# EAGLE design maze_expander_1_0 (EAGLE 6.6.0)
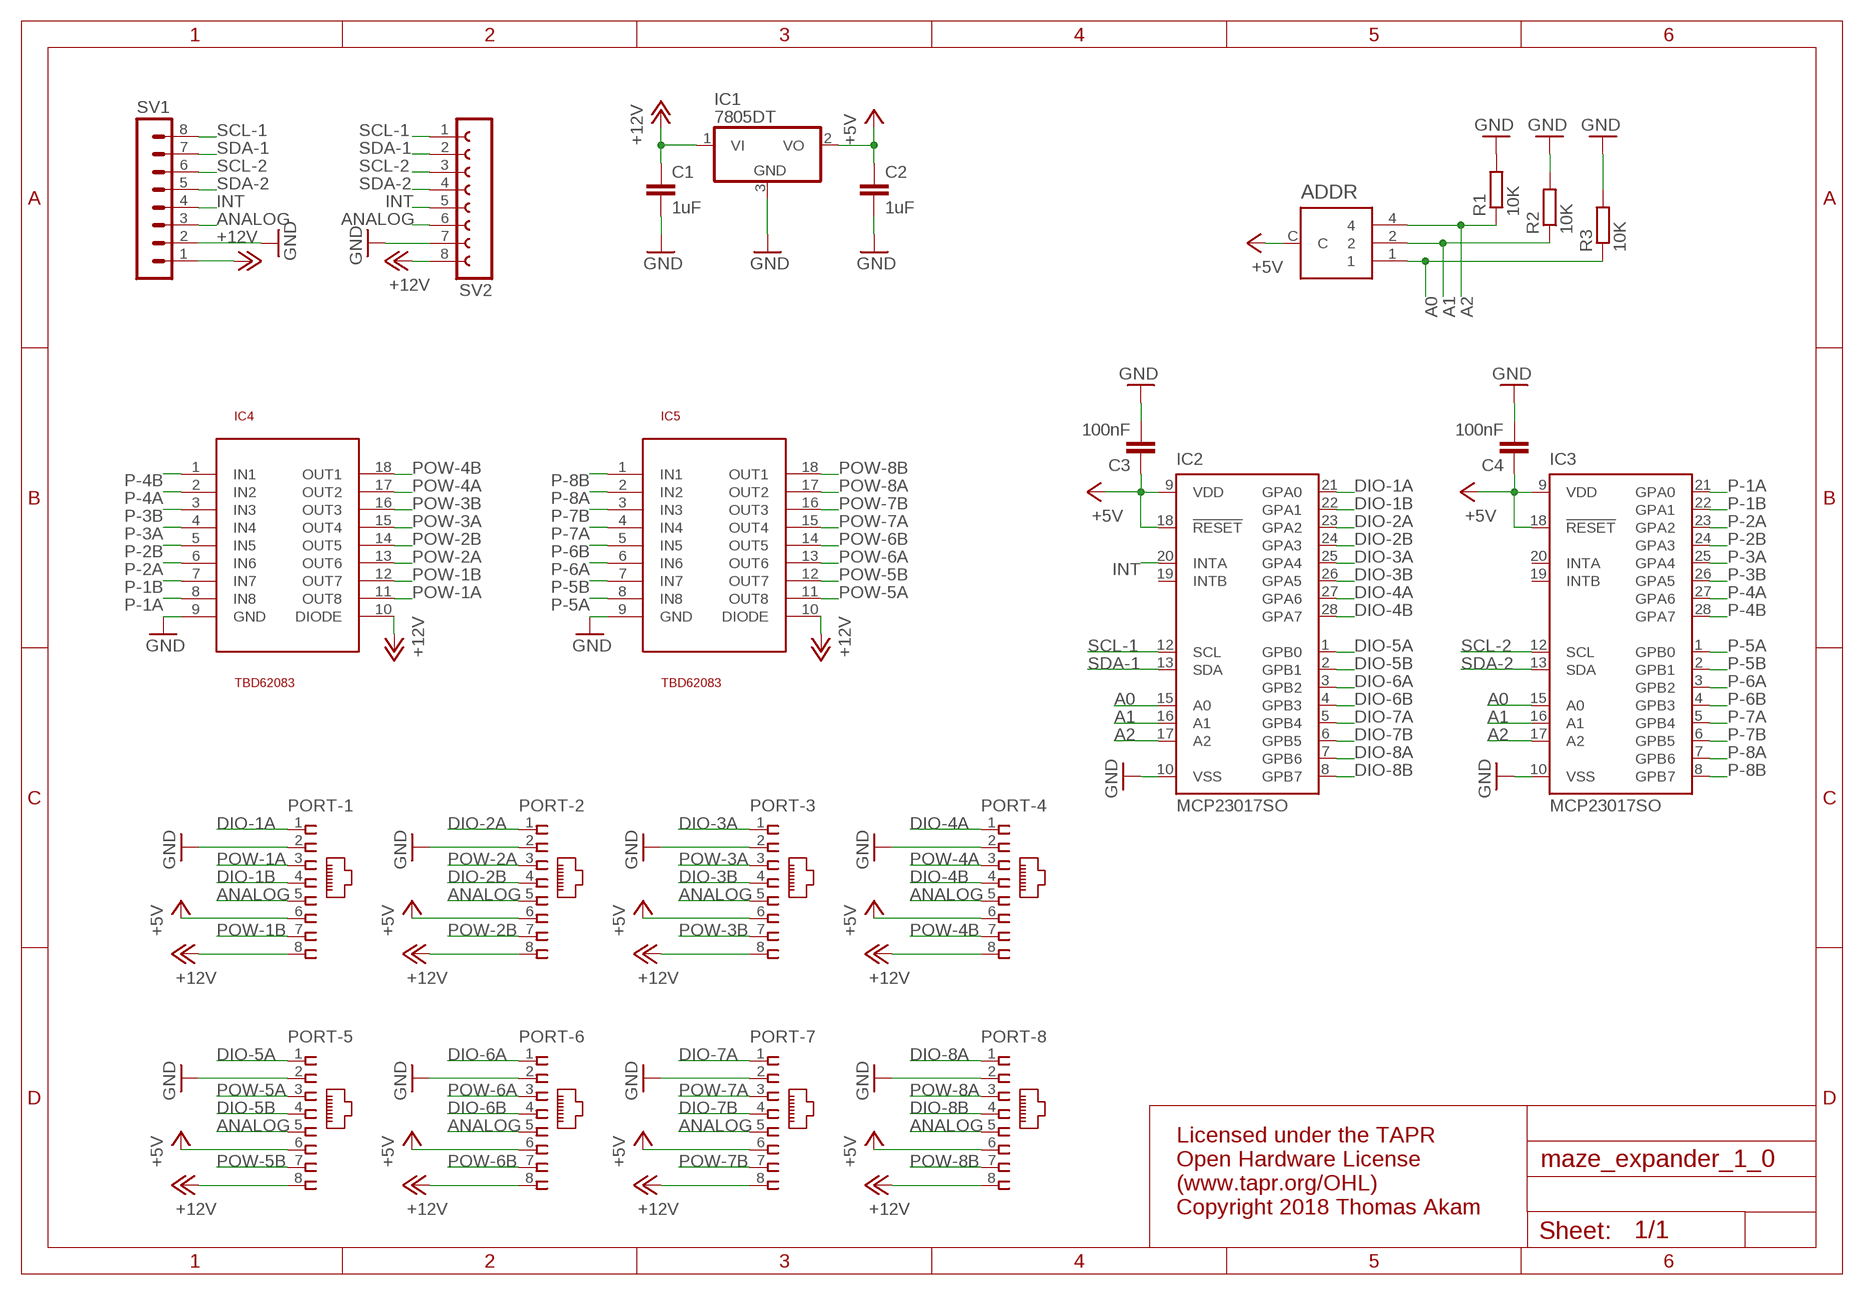
[diagram p0: schematic, sheet 1]

## Parts
ADDR  S-8010  [S-8010]
C1  1uF  C-EUC0805  [C0805]
C2  1uF  C-EUC0805  [C0805]
C3  100nF  C-EUC0805  [C0805]
C4  100nF  C-EUC0805  [C0805]
IC1  7805DT  [TO252]
IC2  MCP23017SO  [SO28W]
IC3  MCP23017SO  [SO28W]
IC4  TBD62083  ULN2803  [SO18L]
IC5  TBD62083  ULN2803  [SO18L]
PORT-1  RJ45VERTICAL  [RJ45-NO-SHIELD-VERTICAL]
PORT-2  RJ45VERTICAL  [RJ45-NO-SHIELD-VERTICAL]
PORT-3  RJ45VERTICAL  [RJ45-NO-SHIELD-VERTICAL]
PORT-4  RJ45VERTICAL  [RJ45-NO-SHIELD-VERTICAL]
PORT-5  RJ45VERTICAL  [RJ45-NO-SHIELD-VERTICAL]
PORT-6  RJ45VERTICAL  [RJ45-NO-SHIELD-VERTICAL]
PORT-7  RJ45VERTICAL  [RJ45-NO-SHIELD-VERTICAL]
PORT-8  RJ45VERTICAL  [RJ45-NO-SHIELD-VERTICAL]
R1  10K  R-EU_R0805  [R0805]
R2  10K  R-EU_R0805  [R0805]
R3  10K  R-EU_R0805  [R0805]
SV1  MA08-1W  [MA08-1W]
SV2  FE08W  [FE08W]

## Nets
+5V: ADDR.C C2.1 C3.1 C4.1 IC1.2(VO) IC2.9(VDD) IC2.18(!RESET) IC3.9(VDD) IC3.18(!RESET) PORT-1.6 PORT-2.6 PORT-3.6 PORT-4.6 PORT-5.6 PORT-6.6 PORT-7.6 PORT-8.6
+12V: C1.1 IC1.1(VI) IC4.10(DIODE) IC5.10(DIODE) PORT-1.8 PORT-2.8 PORT-3.8 PORT-4.8 PORT-5.8 PORT-6.8 PORT-7.8 PORT-8.8 SV1.1 SV2.8
A0: ADDR.1 IC2.15(A0) IC3.15(A0) R3.1
A1: ADDR.2 IC2.16(A1) IC3.16(A1) R2.1
A2: ADDR.4 IC2.17(A2) IC3.17(A2) R1.1
ANALOG: PORT-1.5 PORT-2.5 PORT-3.5 PORT-4.5 PORT-5.5 PORT-6.5 PORT-7.5 PORT-8.5 SV1.3 SV2.6
DIO-1A: IC2.21(GPA0) PORT-1.1
DIO-1B: IC2.22(GPA1) PORT-1.4
DIO-2A: IC2.23(GPA2) PORT-2.1
DIO-2B: IC2.24(GPA3) PORT-2.4
DIO-3A: IC2.25(GPA4) PORT-3.1
DIO-3B: IC2.26(GPA5) PORT-3.4
DIO-4A: IC2.27(GPA6) PORT-4.1
DIO-4B: IC2.28(GPA7) PORT-4.4
DIO-5A: IC2.1(GPB0) PORT-5.1
DIO-5B: IC2.2(GPB1) PORT-5.4
DIO-6A: IC2.3(GPB2) PORT-6.1
DIO-6B: IC2.4(GPB3) PORT-6.4
DIO-7A: IC2.5(GPB4) PORT-7.1
DIO-7B: IC2.6(GPB5) PORT-7.4
DIO-8A: IC2.7(GPB6) PORT-8.1
DIO-8B: IC2.8(GPB7) PORT-8.4
GND: C1.2 C2.2 C3.2 C4.2 IC1.3(GND) IC2.10(VSS) IC3.10(VSS) IC4.9(GND) IC5.9(GND) PORT-1.2 PORT-2.2 PORT-3.2 PORT-4.2 PORT-5.2 PORT-6.2 PORT-7.2 PORT-8.2 R1.2 R2.2 R3.2 SV1.2 SV2.7
INT: IC2.20(INTA) SV1.4 SV2.5
P-1A: IC3.21(GPA0) IC4.8(IN8)
P-1B: IC3.22(GPA1) IC4.7(IN7)
P-2A: IC3.23(GPA2) IC4.6(IN6)
P-2B: IC3.24(GPA3) IC4.5(IN5)
P-3A: IC3.25(GPA4) IC4.4(IN4)
P-3B: IC3.26(GPA5) IC4.3(IN3)
P-4A: IC3.27(GPA6) IC4.2(IN2)
P-4B: IC3.28(GPA7) IC4.1(IN1)
P-5A: IC3.1(GPB0) IC5.8(IN8)
P-5B: IC3.2(GPB1) IC5.7(IN7)
P-6A: IC3.3(GPB2) IC5.6(IN6)
P-6B: IC3.4(GPB3) IC5.5(IN5)
P-7A: IC3.5(GPB4) IC5.4(IN4)
P-7B: IC3.6(GPB5) IC5.3(IN3)
P-8A: IC3.7(GPB6) IC5.2(IN2)
P-8B: IC3.8(GPB7) IC5.1(IN1)
POW-1A: IC4.11(OUT8) PORT-1.3
POW-1B: IC4.12(OUT7) PORT-1.7
POW-2A: IC4.13(OUT6) PORT-2.3
POW-2B: IC4.14(OUT5) PORT-2.7
POW-3A: IC4.15(OUT4) PORT-3.3
POW-3B: IC4.16(OUT3) PORT-3.7
POW-4A: IC4.17(OUT2) PORT-4.3
POW-4B: IC4.18(OUT1) PORT-4.7
POW-5A: IC5.11(OUT8) PORT-5.3
POW-5B: IC5.12(OUT7) PORT-5.7
POW-6A: IC5.13(OUT6) PORT-6.3
POW-6B: IC5.14(OUT5) PORT-6.7
POW-7A: IC5.15(OUT4) PORT-7.3
POW-7B: IC5.16(OUT3) PORT-7.7
POW-8A: IC5.17(OUT2) PORT-8.3
POW-8B: IC5.18(OUT1) PORT-8.7
SCL-1: IC2.12(SCL) SV1.8 SV2.1
SCL-2: IC3.12(SCL) SV1.6 SV2.3
SDA-1: IC2.13(SDA) SV1.7 SV2.2
SDA-2: IC3.13(SDA) SV1.5 SV2.4
Unconnected: IC2.19(INTB) IC3.19(INTB) IC3.20(INTA)

## Notes on the sheet
- Licensed under the TAPR
  Open Hardware License
  (www.tapr.org/OHL)
  Copyright 2018 Thomas Akam

## Library data of the parts
ADDR = ultra_librarian:S-8010: NIDEC COPAL ELECTRONICS S-8010 coded rotary switch
C1-C4 = resistor:C-EU: CAPACITOR, European symbol
IC1 = linear:78*: Positive VOLTAGE REGULATOR Source: http://cache.national.com/ds/LM/LM78L05.pdf http://www.fairchildsemi.com/ds/LM/LM7805.pdf
IC2 IC3 = microchip:MCP23017: http://ww1.microchip.com/downloads/en/DeviceDoc/21952a.pdf Source: http://ww1.microchip.com/downloads/en/DeviceDoc/21952a.pdf; MF: MICROCHIP; MPN: MCP23017-E/SO; OC_FARNELL: 1332087; OC_NEWARK: 31K2958
IC4 IC5 = uln2803:ULN2803
PORT-1-PORT-8 = con-tycoelectronics-vertical_RJ45:RJ45: CORCOM Modular RJ Jacks No Shield Source: www.tycoelectronics.com .. ENG_DS_1654001_1099_RJ_L_0507.pdf
R1-R3 = rcl:R-EU_: RESISTOR, European symbol
SV1 = con-lstb:MA08-1W: PIN HEADER; OC_FARNELL: unknown; OC_NEWARK: unknown
SV2 = con-lsta:FE08W: FEMALE HEADER; OC_FARNELL: unknown; OC_NEWARK: unknown

## Board
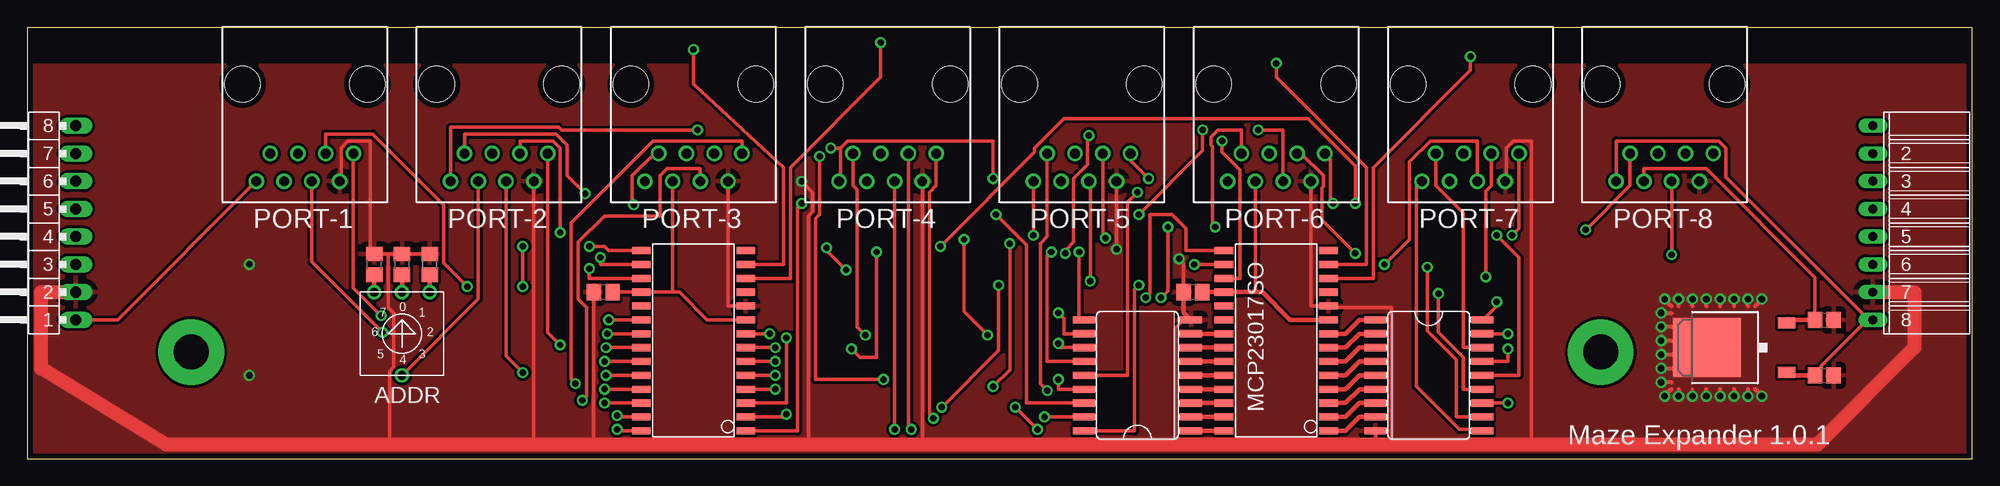
[diagram p1: board, top side]
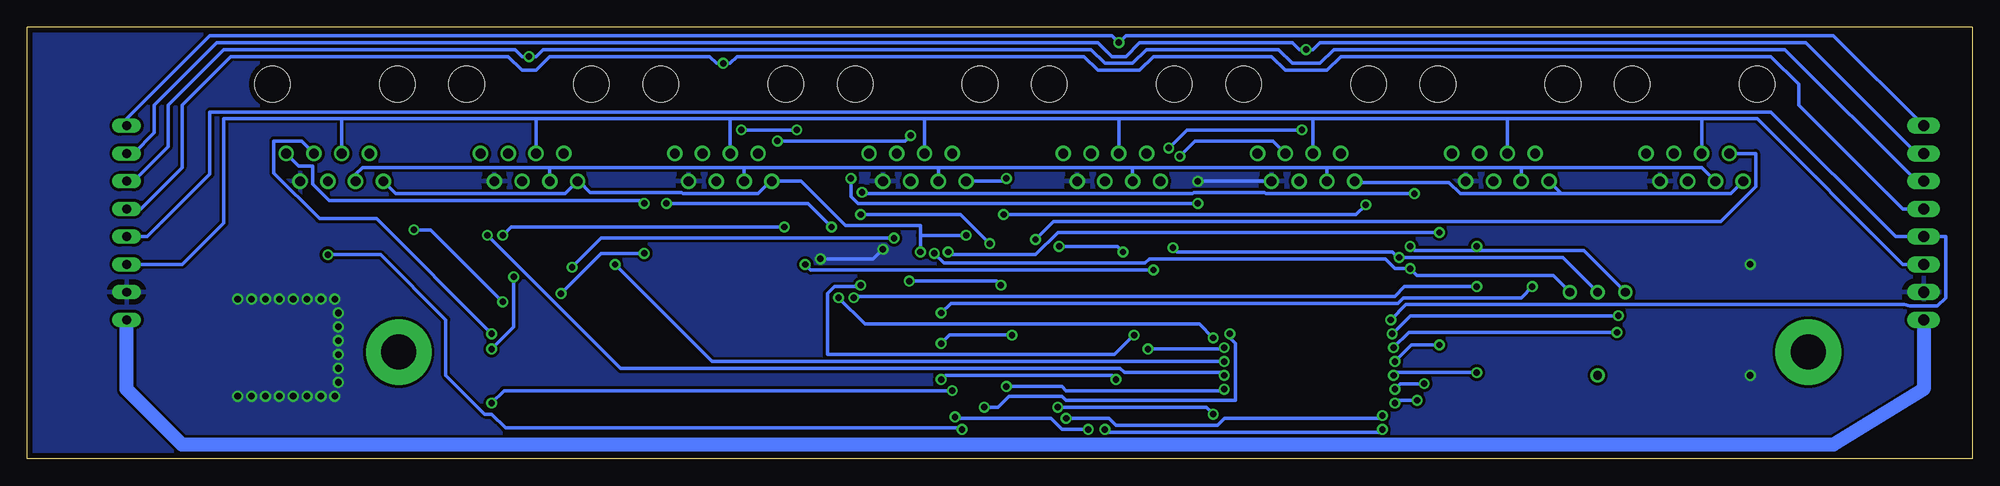
[diagram p2: board, bottom side, seen from below]

Size 178 x 39.5 mm. Coordinates in mm from the lower left corner, seen from the top.
Outline: 0,0 178,0 178,39.5 0,39.5 0,0
Copper layers (1*16): Top 0.035mm / dielectric 1.5mm / Bottom 0.035mm
Design rules "default *": minimum track width 12mil, minimum drill 23mil, track to track 10mil, track to pad 10mil, pad to pad 10mil, via to via 10mil, smd to smd 10mil, copper to edge 20mil, drill to drill 8mil, minimum pad ring 10mil, minimum via ring 8mil, stop-mask expansion 4mil, vias tented up to drill 0mil, thermal gap 20mil
tRestrict: area 0,36.2 to 178,39.5
vRestrict: area 57.1,1.9 to 64.8,19.8; area 97.8,1.8 to 105.4,13.6; area 20.3,21 to 29.8,22.9; area 55.9,21 to 65.4,22.9; area 110.2,1.8 to 117.9,19.6; area 124.8,1.8 to 132.5,13.2; area 109.2,21 to 118.7,23.5; area 127,21 to 136.5,23.5; area 144.8,21 to 154.3,23.5; area 73.7,21 to 83.2,23.5; area 91.4,21 to 101,23.5; area 38.1,21 to 47.6,23.5; 2 more areas

### Footprints (pad centres in the part's own frame; a part is rotated, then mirrored left to right if it is on the bottom)
S-8010 = drill 0.8: 1 -2.54,3.81; 2 0,3.81; 4 2.54,3.81; C 0,-3.81
C0805 = smd 1.3 x 1.5: 1 -0.85,0; 2 0.85,0
TO252 = smd 1 x 1.6: 1 -2.28,-4.8; 2 2.28,-4.8 | smd 5.4 x 6.2: 3 0,2.5
SO28W = smd 0.65 x 1.7: 1 -7.62,-4.78; 2 -6.35,-4.78; 3 -5.08,-4.78; 4 -3.81,-4.78; 5 -2.54,-4.78; 6 -1.27,-4.78; 7 0,-4.78; 8 1.27,-4.78; 9 2.54,-4.78; 10 3.81,-4.78; 11 5.08,-4.78; 12 6.35,-4.78; 13 7.62,-4.78; 14 8.89,-4.78; 15 8.89,4.78; 16 7.62,4.78; 17 6.35,4.78; 18 5.08,4.78; 19 3.81,4.78; 20 2.54,4.78; 21 1.27,4.78; 22 0,4.78; 23 -1.27,4.78; 24 -2.54,4.78; 25 -3.81,4.78; 26 -5.08,4.78; 27 -6.35,4.78; 28 -7.62,4.78
SO18L = smd 0.66 x 2.032: 1 -5.08,-4.902; 2 -3.81,-4.902; 3 -2.54,-4.902; 4 -1.27,-4.902; 5 0,-4.902; 6 1.27,-4.902; 7 2.54,-4.902; 8 3.81,-4.902; 9 5.08,-4.902; 10 5.08,4.902; 11 3.81,4.902; 12 2.54,4.902; 13 1.27,4.902; 14 0,4.902; 15 -1.27,4.902; 16 -2.54,4.902; 17 -3.81,4.902; 18 -5.08,4.902
RJ45-NO-SHIELD-VERTICAL = drill 0.9 pad 1.4: 1 -4.445,5.08; 2 -3.175,7.62; 3 -1.905,5.08; 4 -0.635,7.62; 5 0.635,5.08; 6 1.905,7.62; 7 3.175,5.08; 8 4.445,7.62 | hole 3.251: -5.715,-1.27; 5.715,-1.27
R0805 = smd 1.3 x 1.5: 1 -0.95,0; 2 0.95,0
MA08-1W = drill 1.016 long: 1 -8.89,0; 2 -6.35,0; 3 -3.81,0; 4 -1.27,0; 5 1.27,0; 6 3.81,0; 7 6.35,0; 8 8.89,0
FE08W = drill 0.813 long: 1 -8.89,0; 2 -6.35,0; 3 -3.81,0; 4 -1.27,0; 5 1.27,0; 6 3.81,0; 7 6.35,0; 8 8.89,0

### Placement (x,y rotation side)
ADDR  34.29,11.43 0 top
C1  164.47,7.62 0 top
C2  164.47,12.7 0 top
C3  52.7,15.24 180 top
C4  106.68,15.24 180 top
IC1  156.21,10.16 90 top
IC2  60.96,10.16 90 top
IC3  114.3,10.16 90 top
IC4  101.6,7.62 90 top
IC5  128.27,7.62 270 top
PORT-1  25.4,33.02 180 top
PORT-2  43.18,33.02 180 top
PORT-3  60.96,33.02 180 top
PORT-4  78.74,33.02 180 top
PORT-5  96.52,33.02 180 top
PORT-6  114.3,33.02 180 top
PORT-7  132.08,33.02 180 top
PORT-8  149.86,33.02 180 top
R1  36.83,17.78 90 top
R2  34.29,17.78 90 top
R3  31.75,17.78 90 top
SV1  4.45,21.59 90 top
SV2  168.91,21.59 270 top

### Tracks (layer width: path | path; a pad name or v marks a point on that pad's centre or on a via)
+5V
  Top 0.305: IC2.18 C3.1 59.05,15.24 | 59.05,15.24 59.69,15.24 62.23,12.7 IC2.9 | PORT-8.6 147.96,26.54 153.67,26.54 163.62,16.6 C2.1 | 161.16,12.83 IC1.2 | ADDR.C 41.27,14.61 PORT-2.6 | PORT-6.6 112.39,15.24 | PORT-3.6 59.05,15.24
  Top 0.406: C4.1 IC3.18 112.39,15.24 113.03,15.24 115.57,12.7 IC3.9 | C2.1 161.27,12.7 IC1.2
  Bottom 0.305: PORT-1.6 24.77,26.67 41.27,26.67 | 41.27,26.67 59.05,26.67 | 59.05,26.67 76.83,26.67 | 76.83,26.67 94.61,26.67 | 94.61,26.67 112.39,26.67 | 112.39,26.67 130.18,26.67 | 130.18,26.67 147.32,26.67 147.96,26.04 PORT-8.6 | PORT-2.6 41.27,26.67 | PORT-3.6 59.05,26.67 | PORT-4.6 76.83,26.67 | PORT-5.6 94.61,26.67 | PORT-6.6 112.39,26.67 | PORT-7.6 130.18,26.67
+12V  (via drill 0.58)
  Top 0.305: PORT-4.8 74.42,25.53 74.42,28.45 | 74.42,28.45 75.06,29.08 88.39,29.08 v88.39,25.65 | v96.27,18.92 96.27,13.08 96.65,12.7 IC4.10 | v92.08,20.45 PORT-5.8 | 163.7,7.75 C1.1 163.7,7.87 164.21,8.38 164.21,8.51 168.4,12.7 SV2.8 168.4,12.83 155.45,25.78 155.45,28.45 154.81,29.08 145.41,29.08 PORT-8.8 | PORT-1.8 8.26,12.7 SV1.1 | PORT-7.8 127.13,24.89 127.13,6.6 131.06,2.67 133.1,2.67 IC5.10 | v73.53,28.45 74.42,28.45 | v61.34,30.1 48.9,30.1 48.64,30.35 38.73,30.35 PORT-2.8
  Top 0.406: C1.1 161.27,7.62 IC1.1
  Bottom 0.305: v88.39,25.65 88.65,25.4 PORT-5.8 | PORT-8.8 144.27,24.26 128.78,24.26 PORT-7.8 127.51,25.4 126.49,24.38 118.11,24.38 117.98,24.26 111.12,24.26 109.98,25.4 PORT-6.8 107.19,25.4 103.12,21.34 96.27,21.34 96.27,20.45 | 96.27,20.45 v96.27,18.92 | 96.27,20.45 v92.08,20.45 | PORT-1.8 22.1,24.26 37.59,24.26 | PORT-2.8 37.59,24.26 | PORT-3.8 56.39,25.27 47.88,25.27 46.86,24.26 37.59,24.26 | v73.53,28.45 71.88,30.1 v61.34,30.1
  Bottom 1.27: SV1.1 4.45,6.35 12.7,1.27 163.83,1.27 168.91,6.35 SV2.8
A0  (via drill 0.58)
  Top 0.305: 55.88,19.05 IC2.15 53.21,19.05 52.83,19.43 v51.44,19.43 | IC3.15 106.05,19.05 106.05,21.08 104.78,22.35 102.74,22.35 102.74,15.11 v102.36,14.73 | v45.34,19.43 v45.34,15.75
  Top 0.406: ADDR.1 R3.1
  Bottom 0.305: v51.44,19.43 51.05,19.05 45.34,19.05 | 45.34,19.05 35.56,19.05 ADDR.1 | v102.36,14.73 102.23,14.86 52.83,14.86 51.94,15.75 v45.34,15.75 | 45.34,19.05 v45.34,19.43
A1  (via drill 0.58)
  Top 0.305: IC2.16 52.45,17.78 v52.45,18.41 | v106.81,17.78 IC3.16 | v74.93,17.27 73.15,19.05 v73.15,19.3
  Top 0.406: ADDR.2 R2.1
  Bottom 0.305: ADDR.2 37.47,18.41 v52.45,18.41 52.58,18.41 53.09,18.92 72.77,18.92 v73.15,19.3 | v106.81,17.78 106.3,17.27 v74.93,17.27
A2  (via drill 0.58)
  Top 0.305: IC2.17 51.44,16.51 v51.44,17.4 | IC3.17 111,16.51 111,26.42 109.35,28.07 v109.35,29.08 | v97.16,29.59 97.03,29.46 97.03,26.92 95.76,25.65 95.76,19.81 95,19.05 v95,18.8
  Top 0.406: ADDR.4 R1.1
  Bottom 0.305: ADDR.4 38.35,16.76 50.8,16.76 v51.44,17.4 52.83,17.4 53.72,18.29 75.31,18.29 75.69,17.91 94.11,17.91 v95,18.8 | v109.35,29.08 97.66,29.08 v97.16,29.59
ANALOG
  Bottom 0.305: SV1.3 6.35,17.78 19.68,31.11 24.77,31.11 | 24.77,31.11 42.55,31.11 | 42.55,31.11 60.33,31.11 | 60.33,31.11 78.11,31.11 | 78.11,31.11 95.89,31.11 | 95.89,31.11 113.67,31.11 | 113.67,31.11 131.44,31.11 | 131.44,31.11 149.22,31.11 | 149.22,31.11 160.02,31.11 160.02,21.59 163.83,17.78 SV2.6 | PORT-1.5 24.77,31.11 | PORT-2.5 42.55,31.11 | PORT-3.5 60.33,31.11 | PORT-4.5 78.11,31.11 | PORT-5.5 95.89,31.11 | PORT-6.5 113.67,31.11 | PORT-7.5 131.44,31.11 | PORT-8.5 149.22,31.11
DIO-1A  (via drill 0.58)
  Top 0.305: v53.09,11.43 IC2.21 | v32.38,13.08 29.84,15.62 PORT-1.1
  Bottom 0.305: v53.09,11.43 51.44,13.08 v32.38,13.08
DIO-1B  (via drill 0.58)
  Top 0.305: v52.96,10.16 IC2.22 | v32.51,11.56 26.04,18.03 PORT-1.4
  Bottom 0.305: v52.96,10.16 51.56,11.56 v32.51,11.56
DIO-2A  (via drill 0.58)
  Top 0.305: v52.83,8.89 IC2.23 | v48.77,10.41 47.62,11.56 PORT-2.1
  Bottom 0.305: v52.83,8.89 51.31,10.41 v48.77,10.41
DIO-2B  (via drill 0.58)
  Top 0.305: v52.96,7.62 IC2.24 | v45.34,7.87 43.81,9.4 PORT-2.4
  Bottom 0.305: v52.96,7.62 52.7,7.87 v45.34,7.87
DIO-3A  (via drill 0.58)
  Top 0.305: v52.83,6.35 IC2.25 | v50.16,6.86 49.78,7.24 49.78,21.59 57.28,29.08 65.41,29.08 PORT-3.1
  Bottom 0.305: v52.83,6.35 52.32,6.86 v50.16,6.86
DIO-3B  (via drill 0.58)
  Top 0.305: v52.83,5.08 IC2.26 | v50.8,5.33 51.18,5.71 51.18,13.84 50.42,14.61 50.42,19.81 52.83,22.23 57.91,22.23 57.91,25.91 58.55,26.54 61.59,26.54 PORT-3.4
  Bottom 0.305: v52.83,5.08 52.58,5.33 v50.8,5.33
DIO-4A  (via drill 0.58)
  Top 0.305: IC2.27 53.98,3.81 v53.98,3.94 | v82.93,3.68 82.55,4.06 82.55,24.38 83.19,25.02 PORT-4.1
  Bottom 0.305: v53.98,3.94 54.23,3.68 68.45,3.68 69.09,3.05 78.36,3.05 78.99,3.68 v82.93,3.68
DIO-4B  (via drill 0.58)
  Top 0.305: IC2.28 53.98,2.54 v53.98,2.67 | PORT-4.4 v79.38,2.67
  Bottom 0.305: v53.98,2.67 54.23,2.41 79.12,2.41 v79.38,2.67
DIO-5A  (via drill 0.58)
  Top 0.305: IC2.1 70.48,2.54 70.48,22.99 v70.87,23.37 | v102.62,25.65 100.97,27.3 PORT-5.1
  Bottom 0.305: v70.87,23.37 101.98,23.37 102.62,24 v102.62,25.65
DIO-5B  (via drill 0.58)
  Top 0.305: IC2.2 69.47,3.81 v69.47,4.06 | v83.69,4.7 88.9,9.91 v88.9,15.88 | v97.28,16.26 97.28,25.27 PORT-5.4
  Bottom 0.305: v69.47,4.06 70.1,4.7 v83.69,4.7 | v88.9,15.88 89.28,16.26 v97.28,16.26
DIO-6A  (via drill 0.58)
  Top 0.305: IC2.3 69.47,5.08 v69.47,11.05 | v103.76,14.73 104.39,15.37 v104.39,21.21 | v119.51,23.37 119.25,23.62 119.25,27.43 PORT-6.1
  Bottom 0.305: v69.47,11.05 70.74,12.32 101.35,12.32 v103.76,14.73 | v104.39,21.21 106.55,23.37 v119.51,23.37
DIO-6B  (via drill 0.58)
  Top 0.305: v68.45,6.35 IC2.4 | v88.39,6.6 89.92,8.13 v89.92,19.68 | v101.73,22.35 107.57,28.19 v107.57,30.1 | v112.65,30.1 114.94,30.1 PORT-6.4
  Bottom 0.305: v68.45,6.35 68.58,6.22 82.93,6.22 83.31,6.6 v88.39,6.6 | v89.92,19.68 92.58,22.35 v101.73,22.35 | v112.65,30.1 v107.57,30.1
DIO-7A  (via drill 0.58)
  Top 0.305: v68.45,7.62 IC2.5 | v135.89,20.45 136.53,21.08 PORT-7.1
  Bottom 0.305: v68.45,7.62 68.71,7.87 77.6,7.87 77.98,8.26 123.7,8.26 v135.89,20.45
DIO-7B  (via drill 0.58)
  Top 0.305: v68.45,8.89 IC2.6 | v124.21,17.78 126.49,20.07 126.49,27.18 128.4,29.08 132.72,29.08 PORT-7.4
  Bottom 0.305: v68.45,8.89 115.32,8.89 v124.21,17.78
DIO-8A  (via drill 0.58)
  Top 0.305: v68.45,10.16 IC2.7 | v75.44,10.03 76.2,9.27 77.72,9.27 v77.72,18.92 | v83.57,19.43 92.2,28.07 92.2,28.45 94.87,31.11 117.22,31.11 121.54,26.8 v121.54,23.37
  Bottom 0.305: v68.45,10.16 68.58,10.03 v75.44,10.03 | v77.72,18.92 78.23,19.43 v83.57,19.43 | v121.54,23.37 121.79,23.62 150.37,23.62 151.89,25.15 151.89,26.8 153.16,26.8 PORT-8.1
DIO-8B  (via drill 0.58)
  Top 0.305: v67.94,11.43 IC2.8 | v92.46,2.67 v90.42,4.7 | PORT-8.4 v150.5,18.67
  Bottom 0.305: v67.94,11.43 67.94,11.05 67.44,10.54 67.44,5.33 82.93,5.33 83.31,5.71 88.14,5.71 89.15,4.7 v90.42,4.7 | v92.46,2.67 92.58,2.79 134.24,2.79 135.51,4.06 136.14,4.06 139.7,7.62 139.7,12.7 145.67,18.67 v150.5,18.67
GND  (via drill 0.58, 0.6, 0.61)
  Top 0.305: R1.2 R2.2 33.02,18.73 | 33.02,18.73 R3.2 31.62,18.8 31.37,19.05 31.37,29.08 29.34,29.08 28.7,28.45 28.7,25.53 PORT-1.2 | v99.69,19.18 PORT-5.2 | v105.41,18.29 105.79,17.91 105.79,15.37 C4.2 | PORT-6.2 117.47,13.97 IC3.10 119.13,13.84 124.84,13.84 124.84,1.27 | IC2.10 64.14,13.97 PORT-3.2 | 152.4,6.35 v152.4,5.71 | 165.35,7.62 C1.2 | 51.82,1.27 51.82,15.24 C3.2 | 123.44,1.27 123.44,2.54 IC5.9 | 46.35,1.27 PORT-2.2 | 81.92,1.27 PORT-4.2 | PORT-7.2 135.38,25.53 135.38,28.45 136.02,29.08 137.67,29.08 137.67,1.27 | 33.02,18.73 33.02,13.84 33.53,13.34 33.53,8.38 33.15,8 33.15,1.27 | v70.87,25.4 71.88,24.38 71.88,22.61 71.5,22.23 71.5,1.27 | 105.03,1.27 105.03,11.94 106.05,12.95 IC4.9
  Top 0.356: v149.86,14.61 149.54,14.58 150.32,14.12 150.32,14.07 150.5,13.97 | v154.94,5.71 154.94,6.35 | 151.13,13.97 v151.13,14.61 151.23,14.73 | 152.4,13.97 v152.4,14.61 | 153.67,13.97 v153.67,14.61 | 154.94,13.97 v154.94,14.61 | 156.21,13.97 v156.21,14.61 | 157.48,13.97 v157.48,14.61 | v158.75,14.61 158.75,14.58 158.29,14.12 158.29,14.07 158.12,13.97 | 150.5,13.31 149.54,13.31 v149.54,13.34 | 150.5,12.04 149.54,12.04 v149.54,12.06 | 150.5,10.77 149.54,10.77 v149.54,10.79 | 150.5,9.5 149.54,9.5 v149.54,9.53 | 150.5,8.23 149.54,8.23 v149.54,8.26 | 150.5,6.96 149.54,6.96 v149.54,6.99 | v149.86,5.71 149.54,5.74 150.32,6.2 150.32,6.25 150.5,6.35 | 151.13,6.35 v151.13,5.71 | 156.21,6.35 v156.21,5.71 | 157.48,6.35 v157.48,5.71 | v158.75,5.71 158.75,5.74 158.29,6.2 158.29,6.25 158.12,6.35
  Top 0.406: v153.67,5.71 153.67,6.35 | C4.2 105.83,13.37 IC4.9
  Top 1.27: SV1.2 1.27,15.24 1.27,8.26 12.7,1.27 33.15,1.27 46.35,1.27 51.82,1.27 71.5,1.27 81.92,1.27 105.03,1.27 123.44,1.27 124.84,1.27 137.67,1.27 163.83,1.27 172.72,10.16 172.72,15.24 SV2.7
  Bottom 0.305: v99.69,19.18 100.58,18.29 v105.41,18.29 | v70.87,25.4 PORT-3.2
  Bottom 0.356: 158.75,14.63 v158.75,14.61 158.88,14.73
  other vias: 20.32,17.78 20.32,7.62
  pour Bottom: 0,0 0,39.5 178,39.5 178,0
  pour Top: 0,0 178,0 178,39.5 0,39.5
  pour Top (no thermals): 158.12,13.97 158.12,6.35 149.86,6.35 149.86,13.97
INT  (via drill 0.58)
  Top 0.305: v53.21,12.7 IC2.20
  Bottom 0.305: v53.21,12.7 51.82,14.1 6.22,14.1 5.71,13.97 3.17,13.97 2.41,14.73 2.41,20.32 SV1.4 6.99,20.32 18.41,31.75 161.29,31.75 161.29,26.04 167,20.32 SV2.5
N$2  (via drill 3.2 pad 6)
  other vias: 15,9.75
N$4  (via drill 3.2 pad 6)
  other vias: 144,9.75
P-1A
  Top 0.406: IC3.21 IC4.8
P-1B
  Top 0.406: IC3.22 IC4.7
P-2A
  Top 0.406: IC3.23 IC4.6
P-2B
  Top 0.406: IC3.24 IC4.5
P-3A
  Top 0.406: IC3.25 IC4.4
P-3B
  Top 0.406: IC4.3 IC3.26
P-4A
  Top 0.406: IC4.2 IC3.27
P-4B
  Top 0.406: IC4.1 IC3.28
P-5A
  Top 0.406: IC3.1 120.65,2.54 121.92,3.81 IC5.8
P-5B
  Top 0.406: IC3.2 120.65,3.81 121.92,5.08 IC5.7
P-6A
  Top 0.406: IC3.3 120.65,5.08 121.92,6.35 IC5.6
P-6B
  Top 0.406: IC3.4 120.65,6.35 121.92,7.62 IC5.5
P-7A
  Top 0.406: IC3.5 120.65,7.62 121.92,8.89 IC5.4
P-7B
  Top 0.406: IC3.6 120.65,8.89 121.92,10.16 IC5.3
P-8A
  Top 0.406: IC3.7 120.65,10.16 121.92,11.43 IC5.2
P-8B
  Top 0.406: IC3.8 120.65,11.43 121.92,12.7 IC5.1
POW-1A  (via drill 0.58)
  Top 0.305: IC4.11 94.87,11.43 94.87,12.83 v94.36,13.34 | v40.26,15.75 38.1,17.91 38.1,23.24 31.62,29.72 27.3,29.72 PORT-1.3
  Bottom 0.305: v94.36,13.34 93.47,14.22 52.58,14.22 52.07,14.73 41.27,14.73 v40.26,15.75
POW-1B  (via drill 0.58)
  Top 0.305: IC4.12 94.36,10.16 v94.36,10.54 | v87.88,11.3 85.72,13.46 v85.72,20.07
  Bottom 0.305: v94.36,10.54 93.6,11.3 v87.88,11.3 | v85.72,20.07 84.07,21.72 22.99,21.72 19.81,24.89 19.81,27.94 PORT-1.7
POW-2A  (via drill 0.58)
  Top 0.305: IC4.13 93.34,8.89 93.34,18.54 v93.73,18.92 | v48.77,20.7 48.77,28.45 48.13,29.08 45.09,29.08 PORT-2.3
  Bottom 0.305: v93.73,18.92 93.47,18.67 85.72,18.67 83.69,20.7 v48.77,20.7
POW-2B  (via drill 0.58)
  Top 0.305: IC4.14 100.71,7.62 100.71,23.5 v101.6,24.38 | v51.05,24.26 49.4,25.91 49.4,28.7 48.39,29.72 40.01,29.72 PORT-2.7
  Bottom 0.305: v101.6,24.38 101.47,24.26 71.37,24.26 71.25,24.38 64.77,24.38 64.64,24.26 v51.05,24.26
POW-3A  (via drill 0.58)
  Top 0.305: IC4.15 94.36,6.35 v94.36,7.24 | v78.36,7.24 72.14,7.24 72.14,21.97 72.52,22.35 v72.52,27.69
  Bottom 0.305: v94.36,7.24 93.98,7.62 78.74,7.62 v78.36,7.24 | v72.52,27.69 71.12,29.08 64.01,29.08 PORT-3.3
POW-3B  (via drill 0.58)
  Top 0.305: IC4.16 91.44,5.08 91.44,19.56 v88.65,22.35 | v55.5,23.24 55.37,23.37 55.37,25.91 57.4,27.94 PORT-3.7
  Bottom 0.305: v88.65,22.35 56.39,22.35 v55.5,23.24
POW-4A  (via drill 0.58)
  Top 0.305: v93.09,3.81 IC4.17 | v80.9,2.67 80.64,2.92 PORT-4.3
  Bottom 0.305: v93.09,3.81 92.96,3.68 84.33,3.68 83.31,2.67 v80.9,2.67
POW-4B  (via drill 0.58)
  Top 0.305: IC4.18 101.35,2.54 101.35,15.49 v101.73,15.88 | v76.71,11.3 75.95,12.06 75.95,24.64 75.56,25.02 PORT-4.7
  Bottom 0.305: v101.73,15.88 101.85,15.75 104.14,15.75 104.78,15.11 104.78,9.53 78.49,9.53 v76.71,11.3
POW-5A  (via drill 0.58)
  Top 0.305: IC5.11 130.81,3.81 130.81,9.02 128.14,11.68 v128.14,17.53 | v98.68,20.19 98.42,20.45 PORT-5.3
  Bottom 0.305: v128.14,17.53 125.48,20.19 v98.68,20.19
POW-5B  (via drill 0.58)
  Top 0.305: v135.51,5.08 IC5.12 | v93.34,6.22 92.71,6.86 92.71,19.68 93.34,20.32 PORT-5.7
  Bottom 0.305: v135.51,5.08 134.37,6.22 v93.34,6.22
POW-6A  (via drill 0.58)
  Top 0.305: IC5.13 131.44,6.35 131.44,9.27 129.16,11.56 v129.16,15.11 | v121.54,18.8 118.49,21.84 118.49,24.77 118.62,24.89 118.62,25.91 116.59,27.94 PORT-6.3
  Bottom 0.305: v129.16,15.11 125.48,18.8 v121.54,18.8
POW-6B  (via drill 0.58)
  Top 0.305: IC5.14 136.53,7.62 136.53,18.41 v134.49,20.45 | v108.71,21.21 108.46,21.46 108.46,28.57 108.33,28.7 108.33,29.46 108.97,30.1 111.12,30.1 PORT-6.7
  Bottom 0.305: v134.49,20.45 133.73,21.21 v108.71,21.21
POW-7A  (via drill 0.58)
  Top 0.305: IC5.15 135.51,8.89 v135.51,10.03 | v133.48,16.64 133.48,24.51 133.99,25.02 PORT-7.3
  Bottom 0.305: v135.51,10.03 133.48,12.06 v133.48,16.64
POW-7B
  Top 0.305: IC5.16 131.44,10.16 131.44,22.48 128.91,25.02 PORT-7.7
POW-8A  (via drill 0.58)
  Top 0.305: v135.51,11.43 IC5.17
  Bottom 0.305: v135.51,11.43 146.05,21.97 151.26,21.97 155.45,26.16 155.45,29.08 152.91,29.08 PORT-8.3
POW-8B  (via drill 0.58)
  Top 0.305: v134.49,14.35 134.49,13.97 133.22,12.7 IC5.18 | v142.62,20.95 146.69,25.02 PORT-8.7
  Bottom 0.305: v134.49,14.35 141.1,20.95 v142.62,20.95
SCL-1  (via drill 0.6)
  Top 0.305: IC2.12 69.85,16.51 69.85,26.67 78.11,34.92 v78.11,38.1
  Bottom 0.305: SV1.8 12.7,38.73 77.47,38.73 v78.11,38.1 78.74,38.73 161.29,38.73 168.91,31.11 SV2.1
SCL-2  (via drill 0.6)
  Top 0.305: IC3.12 123.19,16.51 123.19,26.67 132.08,35.56 v132.08,36.83
  Bottom 0.305: SV1.6 5.08,25.4 17.14,37.47 58.42,37.47 59.69,36.2 62.23,36.2 63.5,37.47 75.56,37.47 76.83,36.2 79.38,36.2 80.64,37.47 130.81,37.47 131.44,36.83 v132.08,36.83 132.72,36.83 133.35,37.47 160.02,37.47 165.1,32.38 165.1,28.57 168.28,25.4 SV2.3
SDA-1  (via drill 0.6)
  Top 0.305: IC2.13 69.22,17.78 69.22,26.67 60.96,34.29 v60.96,37.47
  Bottom 0.305: SV1.7 5.08,27.94 15.24,38.1 59.69,38.1 60.33,37.47 v60.96,37.47 61.59,37.47 62.23,38.1 76.2,38.1 77.47,36.83 78.74,36.83 80.01,38.1 160.66,38.1 166.37,32.38 166.37,29.84 168.28,27.94 SV2.2
SDA-2  (via drill 0.6)
  Top 0.305: IC3.13 122.56,17.78 122.56,26.67 114.3,34.92 v114.3,36.2
  Bottom 0.305: SV1.5 6.35,22.86 15.88,32.38 15.88,34.29 18.41,36.83 57.78,36.83 59.05,35.56 62.87,35.56 64.14,36.83 74.93,36.83 76.2,35.56 80.01,35.56 81.28,36.83 113.03,36.83 113.67,36.2 v114.3,36.2 114.94,36.2 115.57,36.83 130.18,36.83 131.44,35.56 132.72,35.56 133.99,36.83 159.38,36.83 163.83,32.38 163.83,26.67 167.64,22.86 SV2.4

### Text on the board
tNames: Maze Expander 1.0.1
Document: Licensed under the TAPR Open Hardware License / (www.tapr.org/OHL) / Copyright 2018 Thomas Akam
tDocu: Licensed under the TAPR Open Hardware License / (www.tapr.org/OHL) / Copyright 2018 Thomas Akam